# Altium schematic sheet STM32MP1-SOM-COVER.SchDoc: STM32MP1 SOM COVER PAGE
size A4; Author: Vladimir Tyrkin; CompanyName: VR; DocumentNumber: 1; Revision: 1; SheetNumber: 1; SheetTotal: 10
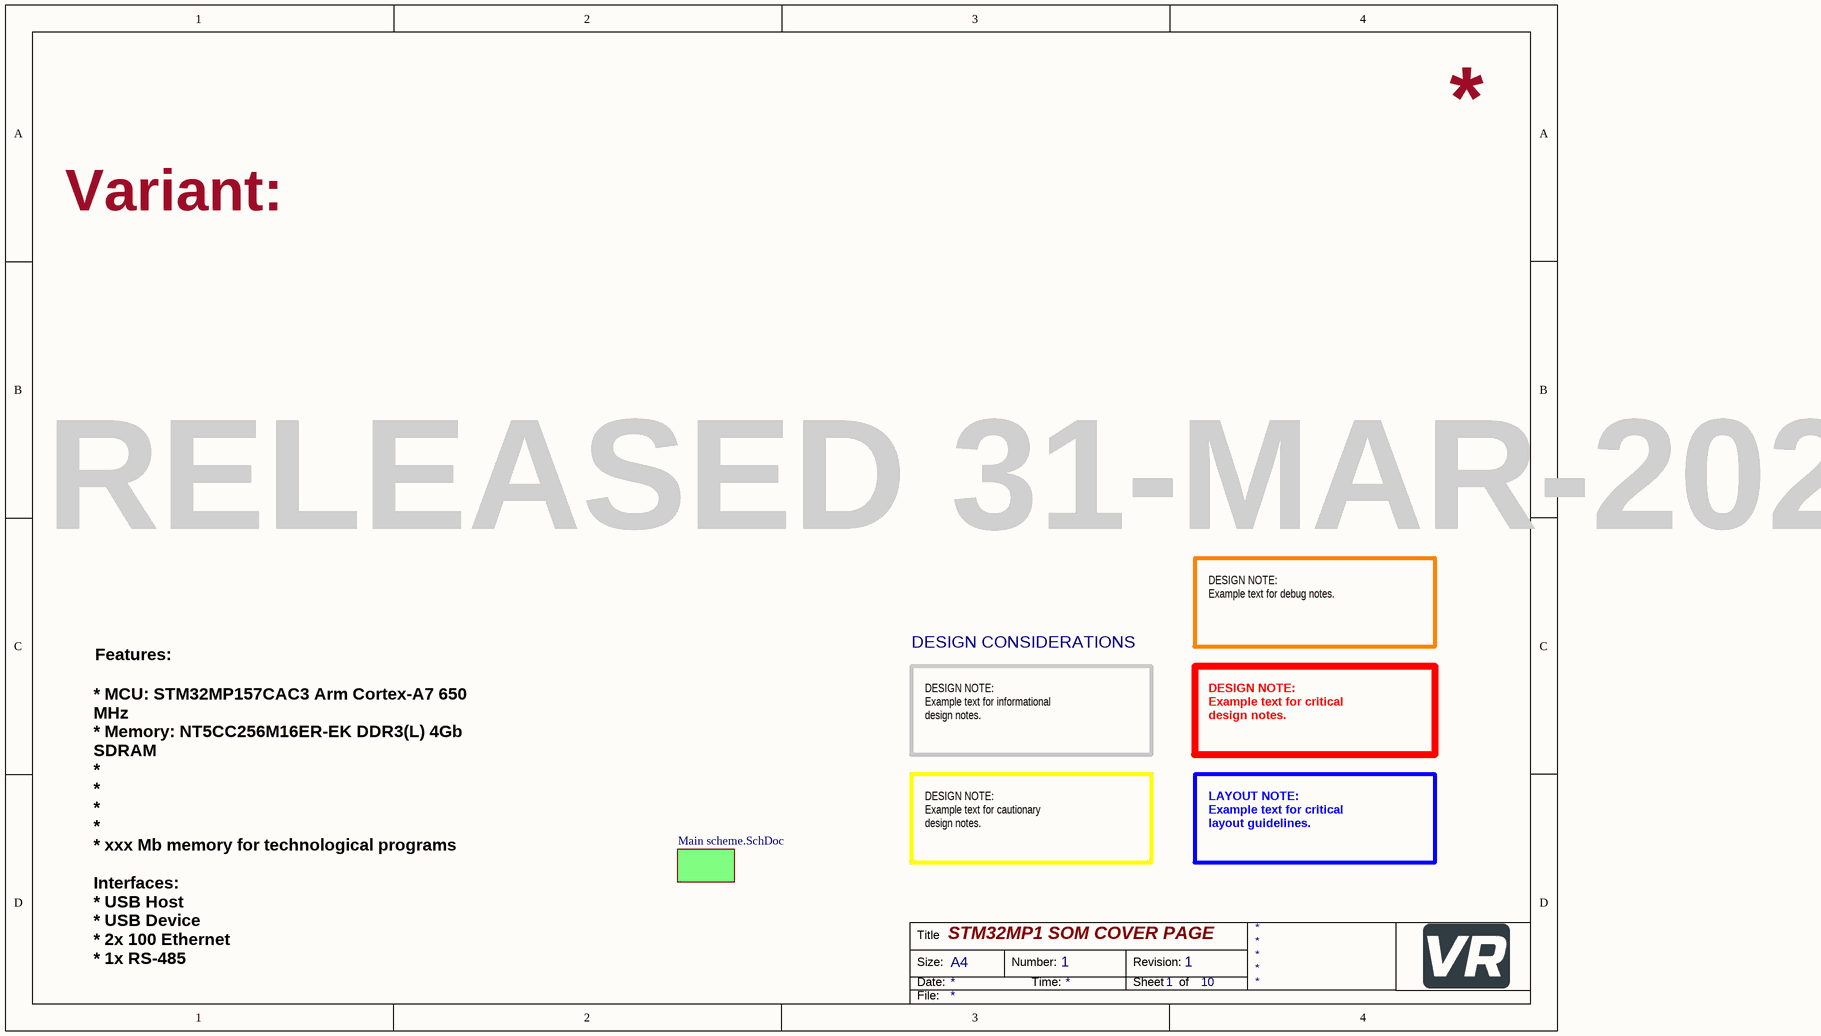
[diagram p0: STM32MP1-SOM-COVER.SchDoc]

## Sub-sheets
Designator = Main scheme.SchDoc: no entries

## Notes on the sheet
- Variant:
- RELEASED 31-MAR-2023
- DESIGN CONSIDERATIONS
- DESIGN NOTE:
  Example text for debug notes.
- Features:
- DESIGN NOTE:
  Example text for informational
  design notes.
- DESIGN NOTE:
  Example text for critical
  design notes.
- DESIGN NOTE:
  Example text for cautionary
  design notes.
- LAYOUT NOTE:
  Example text for critical
  layout guidelines.
- * MCU: STM32MP157CAC3 Arm Cortex-A7 650 MHz
  * Memory: NT5CC256M16ER-EK DDR3(L) 4Gb SDRAM
  *
  *
  *
  *
  * xxx Mb memory for technological programs
  Interfaces:
  * USB Host
  * USB Device
  * 2x 100 Ethernet
  * 1x RS-485
- Title
- Size:
- Date:
- A4
- Number:
- Time:
- Revision:
- Sheet
- of
- File: